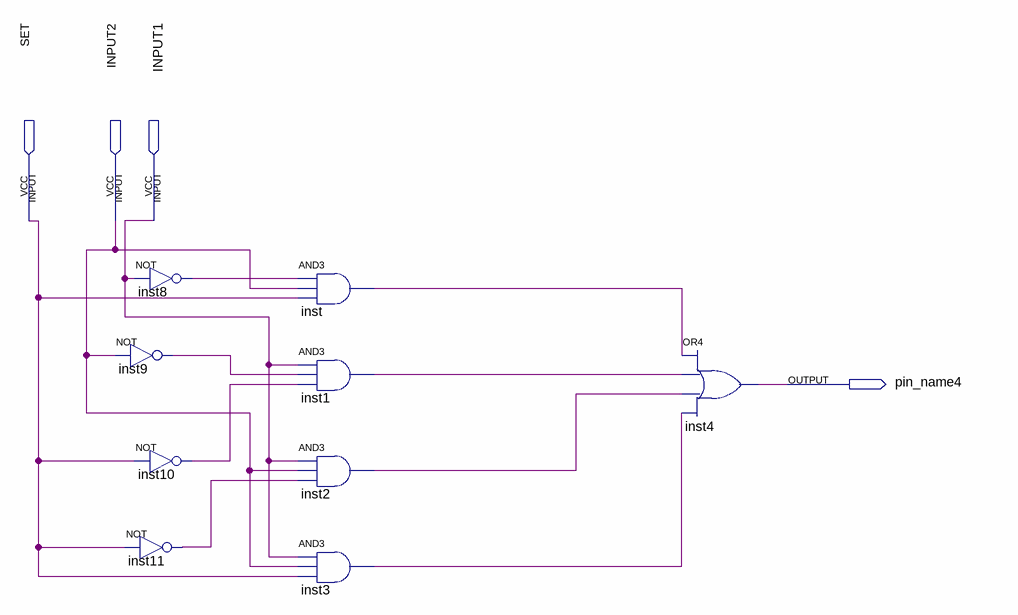
[diagram p0: schematic sheet]
// Quartus schematic MUX_GATE21.bdf as structural Verilog: 9 symbols, 4 pins
module MUX_GATE21 (
  input  SET,
  input  INPUT2,
  input  INPUT1,
  output pin_name4
);

  wire inst1_out, inst2_out, inst3_out, inst8_out, inst9_out, inst10_out, inst11_out, inst_out;

  not inst9 (inst9_out, INPUT2);
  not inst11 (inst11_out, SET);
  not inst8 (inst8_out, INPUT1);
  not inst10 (inst10_out, SET);
  and inst (inst_out, inst8_out, INPUT2, SET);
  and inst1 (inst1_out, INPUT1, inst9_out, inst10_out);
  and inst2 (inst2_out, INPUT1, INPUT2, inst11_out);
  and inst3 (inst3_out, INPUT1, INPUT2, SET);
  or inst4 (pin_name4, inst_out, inst1_out, inst2_out, inst3_out);
endmodule
